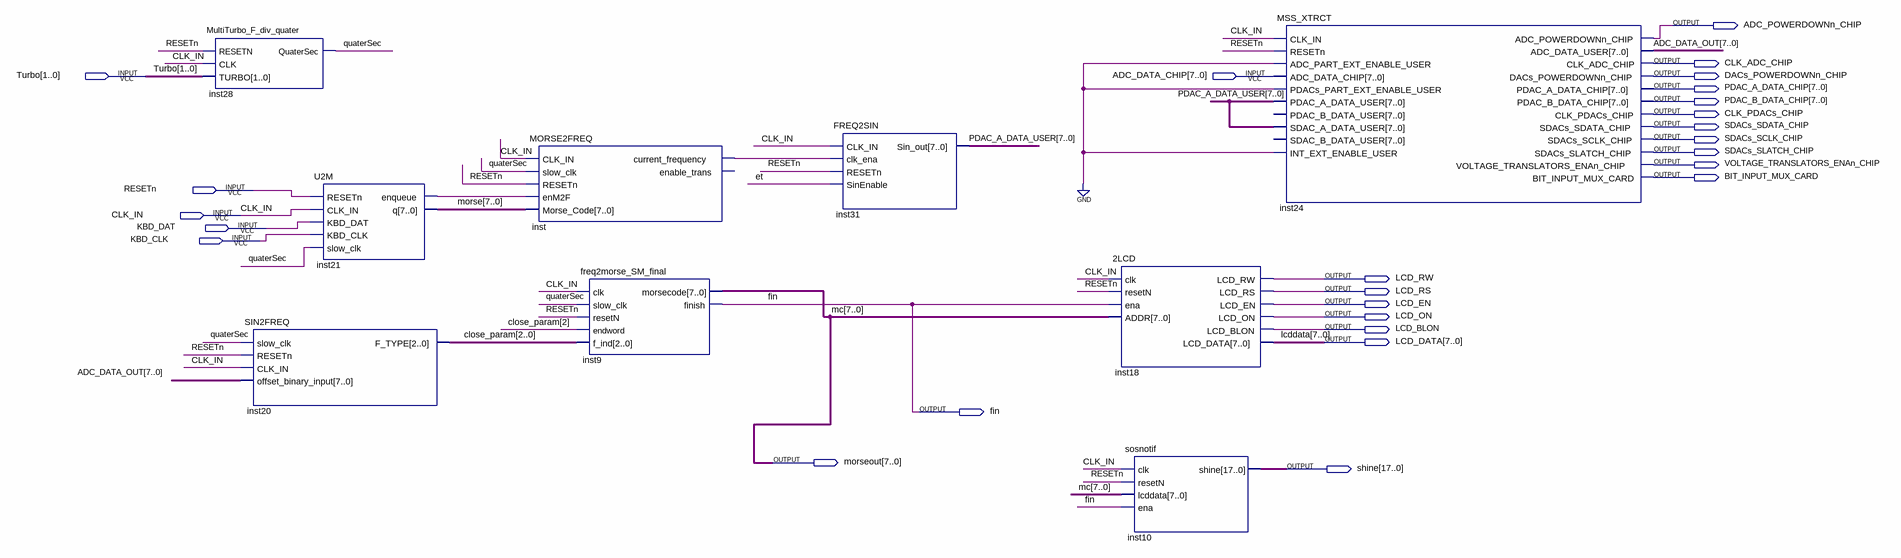
[diagram p0: schematic sheet]
// Quartus schematic Morse_schemat_blockim.bdf as structural Verilog: 9 symbols, 26 pins
module Morse_schemat_blockim (
  input  [1:0] Turbo,
  input  [7:0] ADC_DATA_CHIP,
  input  RESETn,
  input  CLK_IN,
  input  KBD_DAT,
  input  KBD_CLK,
  output ADC_POWERDOWNn_CHIP,
  output CLK_ADC_CHIP,
  output DACs_POWERDOWNn_CHIP,
  output [7:0] PDAC_A_DATA_CHIP,
  output [7:0] PDAC_B_DATA_CHIP,
  output CLK_PDACs_CHIP,
  output SDACs_SDATA_CHIP,
  output SDACs_SCLK_CHIP,
  output SDACs_SLATCH_CHIP,
  output VOLTAGE_TRANSLATORS_ENAn_CHIP,
  output BIT_INPUT_MUX_CARD,
  output LCD_RW,
  output LCD_RS,
  output LCD_EN,
  output LCD_ON,
  output LCD_BLON,
  output [7:0] LCD_DATA,
  output fin,
  output [7:0] morseout,
  output [17:0] shine
);

  wire et, inst21_enqueue, inst_current_frequency, quaterSec;
  wire [2:0] close_param;
  wire [7:0] ADC_DATA_OUT, morse, PDAC_A_DATA_USER;

  MultiTurbo_F_div_quater inst28 (.RESETN(RESETn), .CLK(CLK_IN), .TURBO(Turbo), .QuaterSec(quaterSec));
  SIN2FREQ inst20 (
    .slow_clk(quaterSec), .RESETn(RESETn), .CLK_IN(CLK_IN), .offset_binary_input(ADC_DATA_OUT),
    .F_TYPE(close_param));
  U2M inst21 (
    .RESETn(RESETn), .CLK_IN(CLK_IN), .KBD_DAT(KBD_DAT), .KBD_CLK(KBD_CLK), .slow_clk(quaterSec),
    .enqueue(inst21_enqueue), .q(morse));
  MORSE2FREQ inst (
    .CLK_IN(CLK_IN), .slow_clk(quaterSec), .RESETn(RESETn), .enM2F(inst21_enqueue), .Morse_Code(morse),
    .current_frequency(inst_current_frequency));  // open: enable_trans
  freq2morse_SM_final inst9 (
    .clk(CLK_IN), .slow_clk(quaterSec), .resetN(RESETn), .endword(close_param[2]), .f_ind(close_param),
    .morsecode(morseout), .finish(fin));
  FREQ2SIN inst31 (
    .CLK_IN(CLK_IN), .clk_ena(inst_current_frequency), .RESETn(RESETn), .SinEnable(et),
    .Sin_out(PDAC_A_DATA_USER));
  \2LCD  inst18 (
    .clk(CLK_IN), .resetN(RESETn), .ena(fin), .ADDR(morseout), .LCD_RW(LCD_RW), .LCD_RS(LCD_RS),
    .LCD_EN(LCD_EN), .LCD_ON(LCD_ON), .LCD_BLON(LCD_BLON), .LCD_DATA(LCD_DATA));
  sosnotif inst10 (.clk(CLK_IN), .resetN(RESETn), .lcddata(morseout), .ena(fin), .shine(shine));
  MSS_XTRCT inst24 (
    .CLK_IN(CLK_IN), .RESETn(RESETn), .ADC_PART_EXT_ENABLE_USER(1'b0), .ADC_DATA_CHIP(ADC_DATA_CHIP),
    .PDACs_PART_EXT_ENABLE_USER(1'b0), .PDAC_A_DATA_USER(PDAC_A_DATA_USER),
    .SDAC_A_DATA_USER(PDAC_A_DATA_USER), .INT_EXT_ENABLE_USER(1'b0),
    .ADC_POWERDOWNn_CHIP(ADC_POWERDOWNn_CHIP), .ADC_DATA_USER(ADC_DATA_OUT), .CLK_ADC_CHIP(CLK_ADC_CHIP),
    .DACs_POWERDOWNn_CHIP(DACs_POWERDOWNn_CHIP), .PDAC_A_DATA_CHIP(PDAC_A_DATA_CHIP),
    .PDAC_B_DATA_CHIP(PDAC_B_DATA_CHIP), .CLK_PDACs_CHIP(CLK_PDACs_CHIP),
    .SDACs_SDATA_CHIP(SDACs_SDATA_CHIP), .SDACs_SCLK_CHIP(SDACs_SCLK_CHIP),
    .SDACs_SLATCH_CHIP(SDACs_SLATCH_CHIP), .VOLTAGE_TRANSLATORS_ENAn_CHIP(VOLTAGE_TRANSLATORS_ENAn_CHIP),
    .BIT_INPUT_MUX_CARD(BIT_INPUT_MUX_CARD));  // open: PDAC_B_DATA_USER, SDAC_B_DATA_USER

  // Other names for the same wires on the sheet: lcddata[7:0] = LCD_DATA; mc[7:0] = morseout
endmodule
